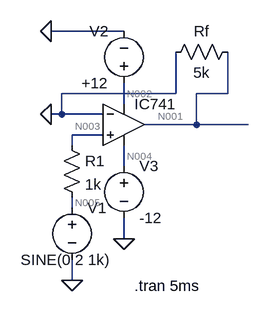
[diagram p0: schematic noninverting closeloop.asc]
noninverting closeloop.asc, the LTspice schematic file:
Version 4
SHEET 1 880 680
WIRE 208 32 96 32
WIRE 288 128 288 64
WIRE 288 128 112 128
WIRE 368 128 368 64
WIRE 368 128 320 128
WIRE 208 144 208 112
WIRE 112 160 112 128
WIRE 112 160 96 160
WIRE 176 160 112 160
WIRE 320 176 320 128
WIRE 320 176 240 176
WIRE 400 176 320 176
WIRE 176 192 128 192
WIRE 128 208 128 192
WIRE 208 240 208 208
WIRE 128 304 128 288
WIRE 208 352 208 320
WIRE 128 416 128 384
FLAG 128 416 0
FLAG 208 352 0
FLAG 96 32 0
FLAG 96 160 0
SYMBOL Opamps\\UniversalOpamp2 208 176 R0
SYMATTR InstName IC741
SYMBOL voltage 128 288 R0
WINDOW 3 -79 96 Left 2
WINDOW 123 0 0 Left 0
WINDOW 39 0 0 Left 0
SYMATTR Value SINE(0 2 1k)
SYMATTR InstName V1
SYMBOL voltage 208 128 R180
WINDOW 0 24 96 Left 2
WINDOW 3 24 16 Left 2
WINDOW 123 0 0 Left 0
WINDOW 39 0 0 Left 0
SYMATTR InstName V2
SYMATTR Value +12
SYMBOL voltage 208 224 R0
WINDOW 123 0 0 Left 0
WINDOW 39 0 0 Left 0
SYMATTR InstName V3
SYMATTR Value -12
SYMBOL res 384 48 R90
WINDOW 0 0 56 VBottom 2
WINDOW 3 32 56 VTop 2
SYMATTR InstName Rf
SYMATTR Value 5k
SYMBOL res 112 192 R0
SYMATTR InstName R1
SYMATTR Value 1k
TEXT 224 424 Left 2 !.tran 5ms

The netlist it stands for:
* noninverting closeloop.asc
XIC741 N003 0 N002 N004 N001 level.2 Avol=1Meg GBW=10Meg Slew=10Meg ilimit=25m rail=0 Vos=0 phimargin=45 en=0 enk=0 in=0 ink=0 Rin=500Meg  ; pins IN+ IN- V+ V- OUT
V1 N005 0 SINE(0 2 1k)
V2 N002 0 +12
V3 N004 0 -12
Rf N001 0 5k
R1 N003 N005 1k
.tran 5ms
.lib UniversalOpamps2.sub
.backanno
.end

* Results of the author's LTspice run, read from the files saved beside the schematic
* Operating Point, zero values left out:
*   V(n002) = 12 V
*   V(n004) = -12 V
*   I(V3) = 1.199 mA
*   I(V2) = -1.199 mA
*   Ix(ic741:3) = 1.199 mA
*   Ix(ic741:4) = -1.199 mA
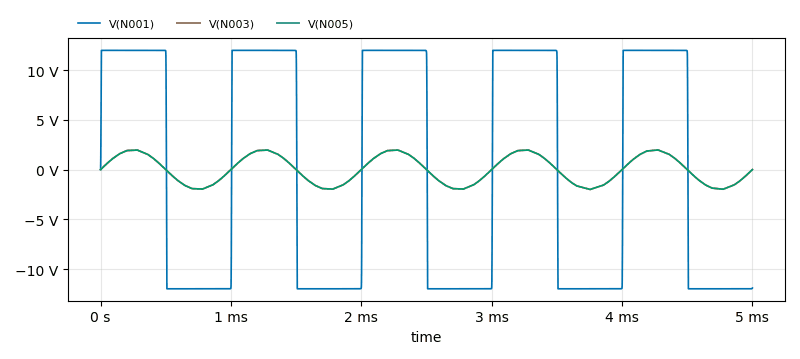
[diagram p1: Transient Analysis of noninverting closeloop.asc, plotted from the saved traces]
* Transient Analysis, 1 run:
*   V(N001): min -11.97 V, max 11.97 V, average 15.57 mV, rms 11.92 V, last -11.9 V
*   V(N003): min -1.996 V, max 1.972 V, average 1.111 mV, rms 1.397 V, last 0 V
*   V(N005): min -1.996 V, max 1.972 V, average 1.111 mV, rms 1.397 V, last 0 V